# EAGLE design charging_block (EAGLE 8.2.0)
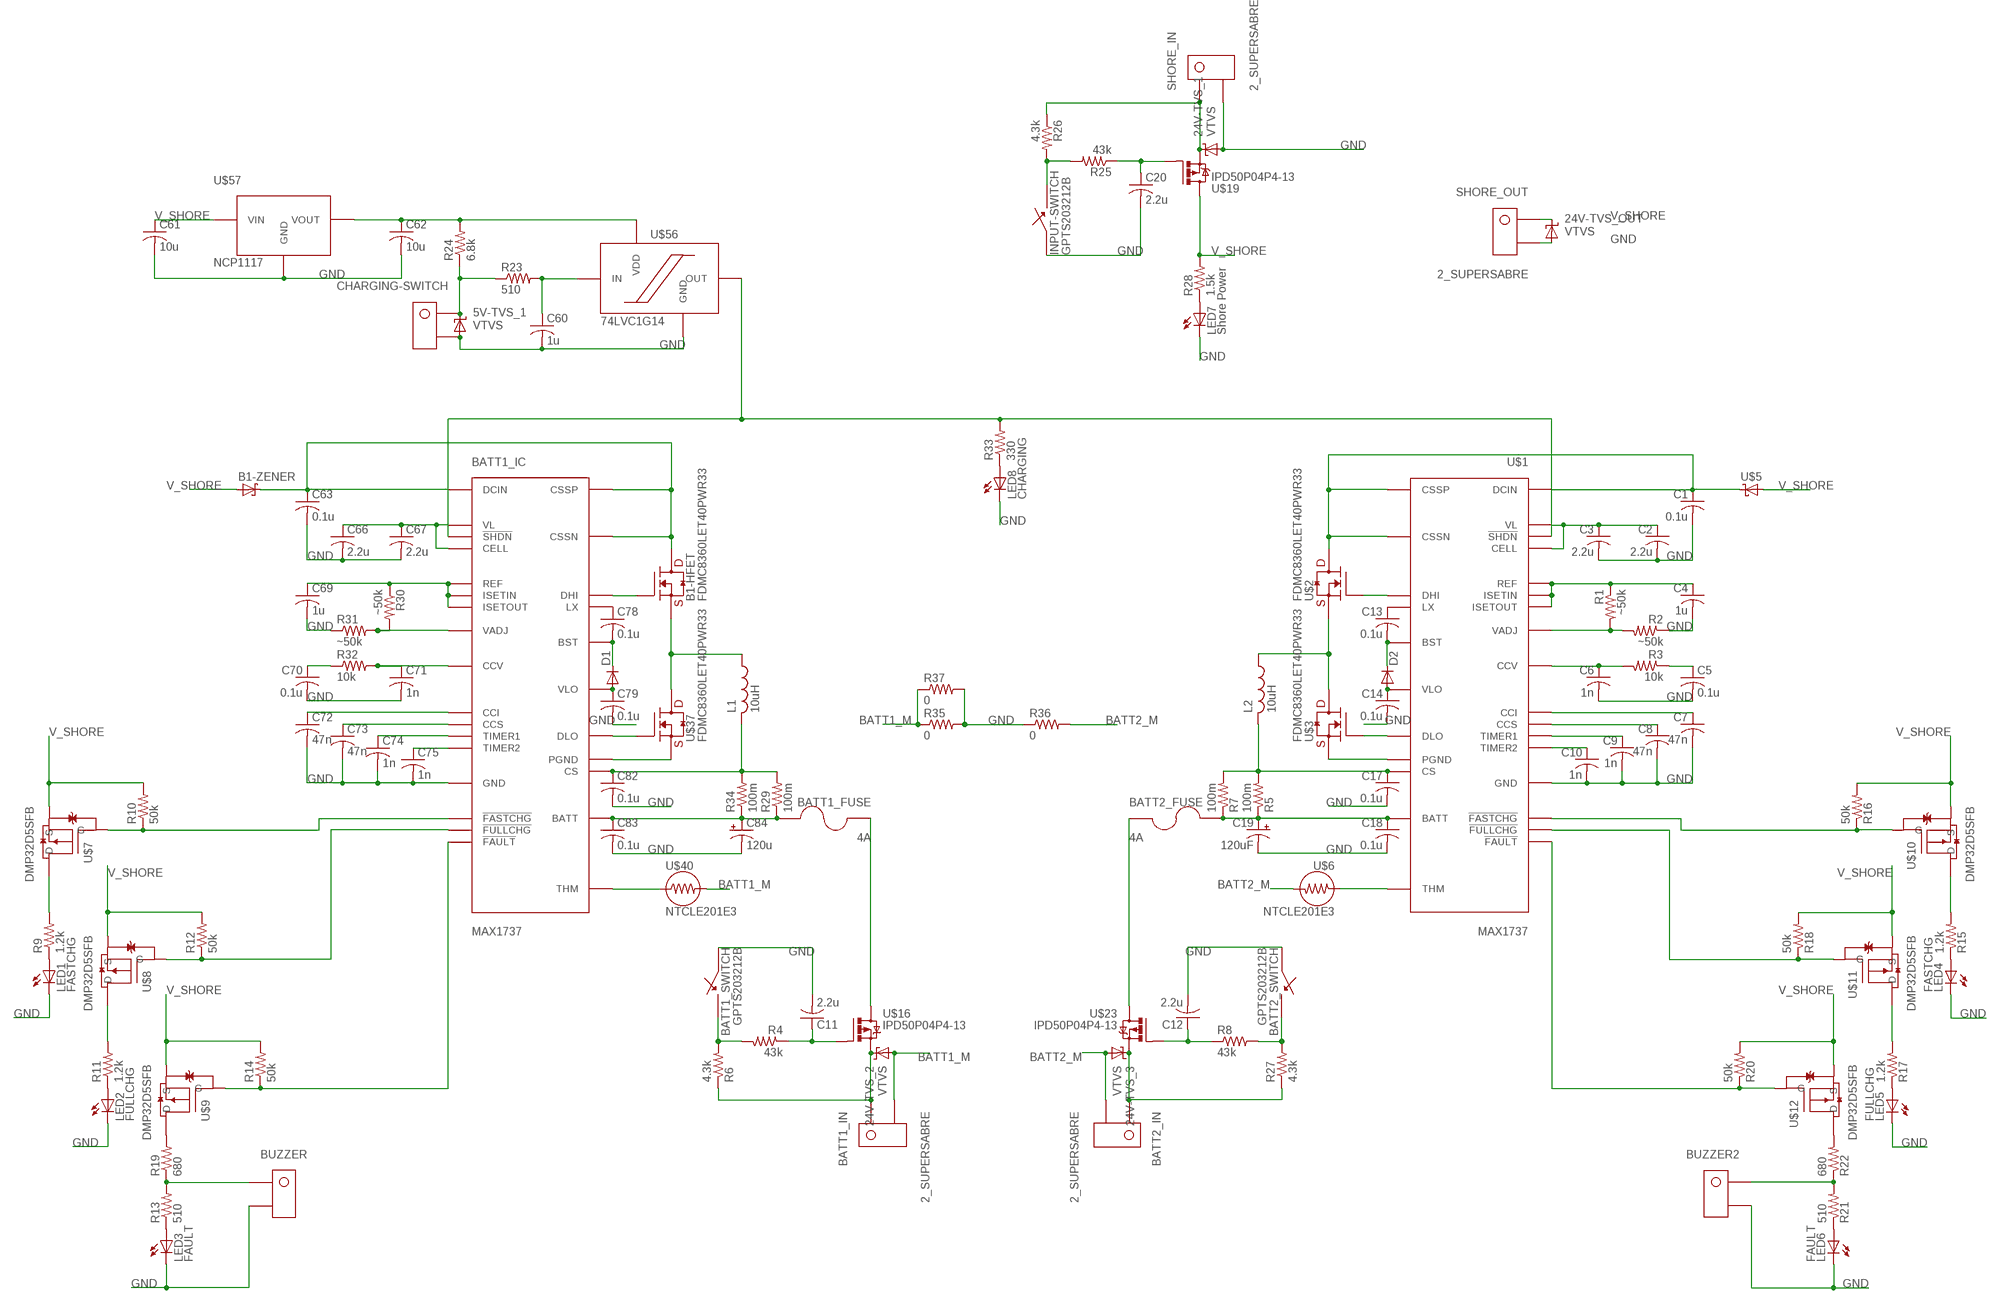
[diagram p0: schematic, sheet 1]

## Parts
5V-TVS_1  VTVS  [DO-219AB]
24V-TVS_1  VTVS  [DO-219AB]
24V-TVS_2  VTVS  [DO-219AB]
24V-TVS_3  VTVS  [DO-219AB]
24V-TVS_OUT  VTVS  [DO-219AB]
B1-HFET  FDMC8360LET40PWR33  [POWER33]
B1-ZENER  SCHOTTKY-DIODESOD-106  [SOD106-R]
BATT1_FUSE  4A  154-OMNI_BLOK  [154-OMNI-BLOK]
BATT1_IC  MAX1737  [QSOP28]
BATT1_IN  2_SUPERSABRE  [SUPERSABRE_2CIRCUIT]
BATT1_SWITCH  GPTS203212B  [GPTS203211B]
BATT2_FUSE  4A  154-OMNI_BLOK  [154-OMNI-BLOK]
BATT2_IN  2_SUPERSABRE  [SUPERSABRE_2CIRCUIT]
BATT2_SWITCH  GPTS203212B  [GPTS203211B]
BUZZER  KK254_VERT_2PIN22-29-2021  [KK254_VERT_2PIN]
BUZZER2  KK254_VERT_2PIN22-29-2021  [KK254_VERT_2PIN]
C1  0.1u  C-USC0805  [C0805]
C2  2.2u  C-USC0805  [C0805]
C3  2.2u  C-USC0805  [C0805]
C4  1u  C-USC0805  [C0805]
C5  0.1u  C-USC0805  [C0805]
C6  1n  C-USC0805  [C0805]
C7  47n  C-USC0805  [C0805]
C8  47n  C-USC0805  [C0805]
C9  1n  C-USC0805  [C0805]
C10  1n  C-USC0805  [C0805]
C11  2.2u  C-USC0805  [C0805]
C12  2.2u  C-USC0805  [C0805]
C13  0.1u  C-USC0805  [C0805]
C14  0.1u  C-USC0805  [C0805]
C17  0.1u  C-USC0805  [C0805]
C18  0.1u  C-USC0805  [C0805]
C19  120uF  CPOL-USE3.5-8  [E3,5-8]
C20  2.2u  C-USC0805  [C0805]
C60  1u  C-USC0805  [C0805]
C61  10u  C-USC0805  [C0805]
C62  10u  C-USC0805  [C0805]
C63  0.1u  C-USC0805  [C0805]
C66  2.2u  C-USC0805  [C0805]
C67  2.2u  C-USC0805  [C0805]
C69  1u  C-USC0805  [C0805]
C70  0.1u  C-USC0805  [C0805]
C71  1n  C-USC0805  [C0805]
C72  47n  C-USC0805  [C0805]
C73  47n  C-USC0805  [C0805]
C74  1n  C-USC0805  [C0805]
C75  1n  C-USC0805  [C0805]
C78  0.1u  C-USC0805  [C0805]
C79  0.1u  C-USC0805  [C0805]
C82  0.1u  C-USC0805  [C0805]
C83  0.1u  C-USC0805  [C0805]
C84  120u  CPOL-USE3.5-8  [E3,5-8]
CHARGING-SWITCH  KK254_VERT_2PIN22-29-2021  [KK254_VERT_2PIN]
D1  DIODE-SOD123  [SOD123]
D2  DIODE-SOD123  [SOD123]
INPUT-SWITCH  GPTS203212B  [GPTS203211B]
L1  10uH  L-USL6100  [L6100]
L2  10uH  L-USL6100  [L6100]
LED1  FASTCHG  LEDCHIP-LED0805  [CHIP-LED0805]
LED2  FULLCHG  LEDCHIP-LED0805  [CHIP-LED0805]
LED3  FAULT  LEDCHIP-LED0805  [CHIP-LED0805]
LED4  FASTCHG  LEDCHIP-LED0805  [CHIP-LED0805]
LED5  FULLCHG  LEDCHIP-LED0805  [CHIP-LED0805]
LED6  FAULT  LEDCHIP-LED0805  [CHIP-LED0805]
LED7  Shore Power  LEDCHIP-LED0805  [CHIP-LED0805]
LED8  CHARGING  LEDCHIP-LED0805  [CHIP-LED0805]
R1  ~50k  R-US_R0805  [R0805]
R2  ~50k  R-US_R0805  [R0805]
R3  10k  R-US_R0805  [R0805]
R4  43k  R-US_R0805  [R0805]
R5  100m  R-US_R2512  [R2512]
R6  4.3k  R-US_R0805  [R0805]
R7  100m  R-US_R2512  [R2512]
R8  43k  R-US_R0805  [R0805]
R9  1.2k  R-US_R0805  [R0805]
R10  50k  R-US_R0805  [R0805]
R11  1.2k  R-US_R0805  [R0805]
R12  50k  R-US_R0805  [R0805]
R13  510  R-US_R0805  [R0805]
R14  50k  R-US_R0805  [R0805]
R15  1.2k  R-US_R0805  [R0805]
R16  50k  R-US_R0805  [R0805]
R17  1.2k  R-US_R0805  [R0805]
R18  50k  R-US_R0805  [R0805]
R19  680  R-US_R0805  [R0805]
R20  50k  R-US_R0805  [R0805]
R21  510  R-US_R0805  [R0805]
R22  680  R-US_R0805  [R0805]
R23  510  R-US_R0805  [R0805]
R24  6.8k  R-US_R0805  [R0805]
R25  43k  R-US_R0805  [R0805]
R26  4.3k  R-US_R0805  [R0805]
R27  4.3k  R-US_R0805  [R0805]
R28  1.5k  R-US_R0805  [R0805]
R29  100m  R-US_R2512  [R2512]
R30  ~50k  R-US_R0805  [R0805]
R31  ~50k  R-US_R0805  [R0805]
R32  10k  R-US_R0805  [R0805]
R33  330  R-US_R0805  [R0805]
R34  100m  R-US_R2512  [R2512]
R35  0  R-US_R0805  [R0805]
R36  0  R-US_R0805  [R0805]
R37  0  R-US_R0805  [R0805]
SHORE_IN  2_SUPERSABRE  [SUPERSABRE_2CIRCUIT]
SHORE_OUT  2_SUPERSABRE  [SUPERSABRE_2CIRCUIT]
U$1  MAX1737  [QSOP28]
U$2  FDMC8360LET40PWR33  [POWER33]
U$3  FDMC8360LET40PWR33  [POWER33]
U$5  SCHOTTKY-DIODESOD-106  [SOD106-R]
U$6  NTCLE201E3  [2-0.3MM-LEADS]
U$7  DMP32D5SFB  [AP02002]
U$8  DMP32D5SFB  [AP02002]
U$9  DMP32D5SFB  [AP02002]
U$10  DMP32D5SFB  [AP02002]
U$11  DMP32D5SFB  [AP02002]
U$12  DMP32D5SFB  [AP02002]
U$16  IPD50P04P4-13  [TO252-3]
U$19  IPD50P04P4-13  [TO252-3]
U$23  IPD50P04P4-13  [TO252-3]
U$37  FDMC8360LET40PWR33  [POWER33]
U$40  NTCLE201E3  [2-0.3MM-LEADS]
U$56  74LVC1G14  [TSSOP5]
U$57  NCP1117  [SOT-223]

## Nets
!SHDN!: BATT1_IC.18(!SHDN!) R33.2 U$1.18(!SHDN!) U$56.P$4(OUT)
BATT1_M: 24V-TVS_2.P$1(A) BATT1_IN.P$2 R35.1 R37.1 U$40.P$2
BATT1_P: 24V-TVS_2.P$2(C) BATT1_IN.P$1 R6.1 U$16.TAB(D)
BATT2_M: 24V-TVS_3.P$1(A) BATT2_IN.P$2 R36.2 U$6.P$2
BATT2_P: 24V-TVS_3.P$2(C) BATT2_IN.P$1 R27.1 U$23.TAB(D)
BATT_1: BATT1_FUSE.P$2 BATT1_IC.7(BATT) C83.1 C84.+ R29.1 R34.1
BATT_2: BATT2_FUSE.P$2 C18.1 C19.+ R5.1 R7.1 U$1.7(BATT)
CS_1: BATT1_IC.19(CS) C82.1 L1.P$2 R29.2 R34.2
CS_2: C17.1 L2.P$2 R5.2 R7.2 U$1.19(CS)
DCIN_2: C1.1 U$1.26(CSSN) U$1.27(CSSP) U$1.28(DCIN) U$2.DRAIN U$5.C
DHI_2: U$1.25(DHI) U$2.GATE
DLO_2: U$1.21(DLO) U$3.GATE
FET-D_1: BATT1_FUSE.P$1 U$16.3(S)
FET-G_1: C11.1 R4.1 U$16.1(G)
GND: 5V-TVS_1.P$1(A) 24V-TVS_1.P$1(A) 24V-TVS_OUT.P$1(A) BATT1_IC.6(GND) BATT1_SWITCH.P$1 BATT2_SWITCH.P$1 BUZZER2.P$2 BUZZER.P$2 C1.2 C2.2 C3.2 C4.2 C5.2 C6.2 C7.2 C8.2 C9.2 C10.2 C11.2 C12.2 C14.2 C17.2 C18.2 C19.- C20.2 C60.2 C61.2 C62.2 C63.2 C66.2 C67.2 C69.2 C70.2 C71.2 C72.2 C73.2 C74.2 C75.2 C79.2 C82.2 C83.2 C84.- CHARGING-SWITCH.P$2 INPUT-SWITCH.P$1 LED1.C LED2.C LED3.C LED4.C LED5.C LED6.C LED7.C LED8.C R2.1 R31.1 R35.2 R36.1 R37.2 SHORE_IN.P$2 SHORE_OUT.P$2 U$1.6(GND) U$56.P$3(GND) U$57.P$1(GND)
L-IN_2: L2.P$1 U$2.SOURCE1(SOURCE) U$2.SOURCE2(SOURCE) U$2.SOURCE3(SOURCE) U$3.DRAIN
N$1: C6.1 R3.2 U$1.9(CCV)
N$2: LED1.A R9.1
N$3: C2.1 C3.1 U$1.1(VL) U$1.12(CELL)
N$4: C4.1 R1.1 U$1.2(ISETIN) U$1.3(ISETOUT) U$1.5(REF)
N$5: C5.1 R3.1
N$6: R1.2 R2.2 U$1.8(VADJ)
N$7: C7.1 U$1.11(CCI)
N$8: C8.1 U$1.10(CCS)
N$9: C9.1 U$1.13(TIMER1)
N$10: C10.1 U$1.14(TIMER2)
N$12: LED3.A R13.1
N$13: C13.1 U$1.24(LX)
N$14: C13.2 D2.C U$1.23(BST)
N$19: C14.1 D2.A U$1.22(VLO)
N$22: LED2.A R11.1
N$23: R9.2 U$7.P$3(D)
N$24: BATT1_IC.16(!FASTCHG!) R10.1 U$7.P$2(G)
N$25: LED4.A R15.1
N$26: R11.2 U$8.P$3(D)
N$27: BATT1_IC.17(!FULLCHG!) R12.1 U$8.P$2(G)
N$28: R15.2 U$10.P$3(D)
N$29: BUZZER.P$1 R13.2 R19.1
N$30: R19.2 U$9.P$3(D)
N$31: BATT1_IC.15(!FAULT!) R14.1 U$9.P$2(G)
N$32: R18.1 U$1.17(!FULLCHG!) U$11.P$2(G)
N$33: LED5.A R17.1
N$34: R17.2 U$11.P$3(D)
N$35: LED7.A R28.1
N$36: R20.1 U$1.15(!FAULT!) U$12.P$2(G)
N$37: LED6.A R21.1
N$38: R16.1 U$1.16(!FASTCHG!) U$10.P$2(G)
N$39: BUZZER2.P$1 R21.2 R22.1
N$40: B1-HFET.DRAIN B1-ZENER.C BATT1_IC.26(CSSN) BATT1_IC.27(CSSP) BATT1_IC.28(DCIN) C63.1
N$41: R22.2 U$12.P$3(D)
N$44: BATT2_FUSE.P$1 U$23.3(S)
N$47: C20.1 R25.1 U$19.1(G)
N$49: C60.1 R23.2 U$56.P$2(IN)
N$50: 5V-TVS_1.P$2(C) CHARGING-SWITCH.P$1 R23.1 R24.1
N$51: INPUT-SWITCH.P$2 R25.2 R26.2
N$52: BATT1_SWITCH.P$2 R4.2 R6.2
N$53: C12.1 R8.1 U$23.1(G)
N$54: C62.1 R24.2 U$56.P$5(VDD) U$57.P$2(VOUT) U$57.P$4(VOUT)
N$55: BATT2_SWITCH.P$2 R8.2 R27.2
N$57: LED8.A R33.1
N$62: BATT1_IC.8(VADJ) R30.2 R31.2
N$64: C70.1 R32.1
N$65: BATT1_IC.1(VL) BATT1_IC.12(CELL) C66.1 C67.1
N$67: BATT1_IC.9(CCV) C71.1 R32.2
N$68: BATT1_IC.2(ISETIN) BATT1_IC.3(ISETOUT) BATT1_IC.5(REF) C69.1 R30.1
N$69: BATT1_IC.11(CCI) C72.1
N$70: BATT1_IC.10(CCS) C73.1
N$71: BATT1_IC.13(TIMER1) C74.1
N$72: BATT1_IC.14(TIMER2) C75.1
N$75: BATT1_IC.24(LX) C78.1
N$76: BATT1_IC.23(BST) C78.2 D1.C
N$79: BATT1_IC.21(DLO) U$37.GATE
N$80: B1-HFET.GATE BATT1_IC.25(DHI)
N$81: B1-HFET.SOURCE1(SOURCE) B1-HFET.SOURCE2(SOURCE) B1-HFET.SOURCE3(SOURCE) L1.P$1 U$37.DRAIN
N$82: BATT1_IC.20(PGND) U$37.SOURCE1(SOURCE) U$37.SOURCE2(SOURCE) U$37.SOURCE3(SOURCE)
N$83: BATT1_IC.22(VLO) C79.1 D1.A
N$84: BATT1_IC.4(THM) U$40.P$1
PGND_2: U$1.20(PGND) U$3.SOURCE1(SOURCE) U$3.SOURCE2(SOURCE) U$3.SOURCE3(SOURCE)
THM_2: U$1.4(THM) U$6.P$1
V_SHORE: 24V-TVS_OUT.P$2(C) B1-ZENER.A C61.1 R10.2 R12.2 R14.2 R16.2 R18.2 R20.2 R28.2 SHORE_OUT.P$1 U$5.A U$7.P$1(S) U$8.P$1(S) U$9.P$1(S) U$10.P$1(S) U$11.P$1(S) U$12.P$1(S) U$19.3(S) U$57.P$3(VIN)
VIN: 24V-TVS_1.P$2(C) R26.1 SHORE_IN.P$1 U$19.TAB(D)

## Library data of the parts
5V-TVS_1 24V-TVS_1-24V-TVS_3 24V-TVS_OUT = diode:VTVS: Vishay VTVS5V0ASMF to VTVS63GSMF 400W TVS diodes Datasheet <http://www.mouser.com/ds/2/427/vtvs5v0asmf-1078013.pdf>
B1-HFET U$2 U$3 U$37 = fairchild:FDMC8360LET40
B1-ZENER U$5 = diode:SCHOTTKY-DIODE: Schottky Diode
BATT1_FUSE BATT2_FUSE = littelfuse:154-OMNI_BLOK: Littelfuse NANO2 Series 154 Omni-Blok fuseholder Datasheet <http://www.mouser.com/ds/2/240/Littelfuse_Fuse_154_154T_154L_154TL_Datasheet.pdf-309941.pdf>
BATT1_IC U$1 = maxim:MAX1737: Maxim MAX1737 Stand-Alone Switch-Mode Lithium-Ion Battery-Charger Controller 1-4 cell LiPo charge controller IC Datasheet <https://datasheets.maximintegrated.com/en/ds/MAX1737.pdf>
BATT1_IN BATT2_IN SHORE_IN SHORE_OUT = molex:2_SUPERSABRE: Molex SuperSabre 2-pin vertical header
BATT1_SWITCH BATT2_SWITCH INPUT-SWITCH = switches:GPTS203212B: CW Industries Pushbutton SPST switch ON-OFF, 1A, 30VDC Datasheet <http://switches-connectors-custom.cwind.com/Asset/GPTS203211BR2.pdf>
BUZZER BUZZER2 CHARGING-SWITCH = molex:KK254_VERT_2PIN: KK® 254 Wire-to-Board Header, Vertical, with Friction Lock, 2 Circuits, Gold (Au) Plating Part Number: 22-29-2021 http://www.molex.com/molex/products/datasheet.jsp?part=active/0022292021_PCB_HEADERS.xml
C1-C14 C17 C18 C20 C60-C63 C66 C67 C69-C75 C78 C79 C82 C83 = resistor:C-US: CAPACITOR, American symbol
C19 C84 = resistor:CPOL-US: POLARIZED CAPACITOR, American symbol
D1 D2 = diode:DIODE-: DIODE
L1 L2 = resistor:L-US: INDUCTOR, American symbol
LED1-LED8 = led:LED: LED OSRAM: - CHIPLED LG R971, LG N971, LY N971, LG Q971, LY Q971, LO R971, LY R971 LH N974, LH R974 LS Q976, LO Q976, LY Q976 LO Q996 - Hyper CHIPLED LW Q18S LB Q993, LB Q99A, LB R99A - SideLED LS A670, LO A670, LY A670, LG A670, LP A670 LB A673, LV A673, LT A673, LW A673 LH A674 LY A675 LS A676, LA A676, LO A676, LY A676, LW A676 LS A679, LY A679, LG A679 - Hyper Micro SIDELED® LS Y876, LA Y876, LO Y876, LY Y876 LT Y87S - SmartLED LW L88C, LW L88S LB L89C, LB L89S, LG L890 LS L89K, LO L89K, LY L89K LS L896, LA L896, LO L896, LY L896 - TOPLED LS T670, LO T670, LY T670, LG T670, LP T670 LSG T670, LSP T670, LSY T670, LOP T670, LYG T670 LG T671, LOG T671, LSG T671 LB T673, LV T673, LT T673, LW T673 LH T674 LS T676, LA T676, LO T676, LY T676, LB T676, LH T676, LSB T676, LW T676 LB T67C, LV T67C, LT T67C, LS T67K, LO T67K, LY T67K, LW E67C LS E67B, LA E67B, LO E67B, LY E67B, LB E67C, LV E67C, LT E67C LW T67C LS T679, LY T679, LG T679 LS T770, LO T770, LY T770, LG T770, LP T770 LB T773, LV T773, LT T773, LW T773 LH T774 LS E675, LA E675, LY E675, LS T675 LS T776, LA T776, LO T776, LY T776, LB T776 LHGB T686 LT T68C, LB T68C - Hyper Mini TOPLED® LB M676 - Mini TOPLED Santana® LG M470 LS M47K, LO M47K, LY M47K Source: http://www.osram.convergy.de LUXEON: - LUMILED® LXK2-PW12-R00, LXK2-PW12-S00, LXK2-PW14-U00, LXK2-PW14-V00 LXK2-PM12-R00, LXK2-PM12-S00, LXK2-PM14-U00 LXK2-PE12-Q00, LXK2-PE12-R00, LXK2-PE12-S00, LXK2-PE14-T00, LXK2-PE14-U00 LXK2-PB12-K00, LXK2-PB12-L00, LXK2-PB12-M00, LXK2-PB14-N00, LXK2-PB14-P00, LXK2-PB14-Q00 LXK2-PR12-L00, LXK2-PR12-M00, LXK2-PR14-Q00, LXK2-PR14-R00 LXK2-PD12-Q00, LXK2-PD12-R00, LXK2-PD12-S00 LXK2-PH12-R00, LXK2-PH12-S00 LXK2-PL12-P00, LXK2-PL12-Q00, LXK2-PL12-R00 Source: www.luxeon.com KINGBRIGHT: KA-3528ASYC Source: www.kingbright.com
R1-R37 = resistor:R-US_: RESISTOR, American symbol
U$6 U$40 = vishay:NTCLE201E3: Vishay NTC Thermistor Part No. NTCLE201E3 Datasheet <http://www.mouser.com/ds/2/427/ntclesb-278158.pdf>
U$7-U$12 = transistor-fet:DMP32D5SFB: Diodes Inc. DMP32D5SFB 30V P-MOSFET (Enhancement) Datasheet <http://www.mouser.com/ds/2/115/DMP32D5SFB-765036.pdf>
U$16 U$19 U$23 = transistor-power:IPD50P04P4-13: Infineon IPD50P04P4-13 OptiMOS®-P2 Power-Transistor Datasheet <http://www.mouser.com/ds/2/196/Infineon-IPD50P04P4-13-DS-v01_02-EN-336147.pdf>
U$56 = NXP:74LVC1G14: Nexperia 74LVC1G14 Single Schmitt trigger inverter Datasheet <http://www.mouser.com/ds/2/302/74LVC1G14_Q100-839654.pdf>
U$57 = ONSemi:NCP1117: ON Semiconductor NCP1117 5V 1A Fixed LDO Datasheet <http://www.mouser.com/ds/2/308/NCP1117-D-81326.pdf>

## Board
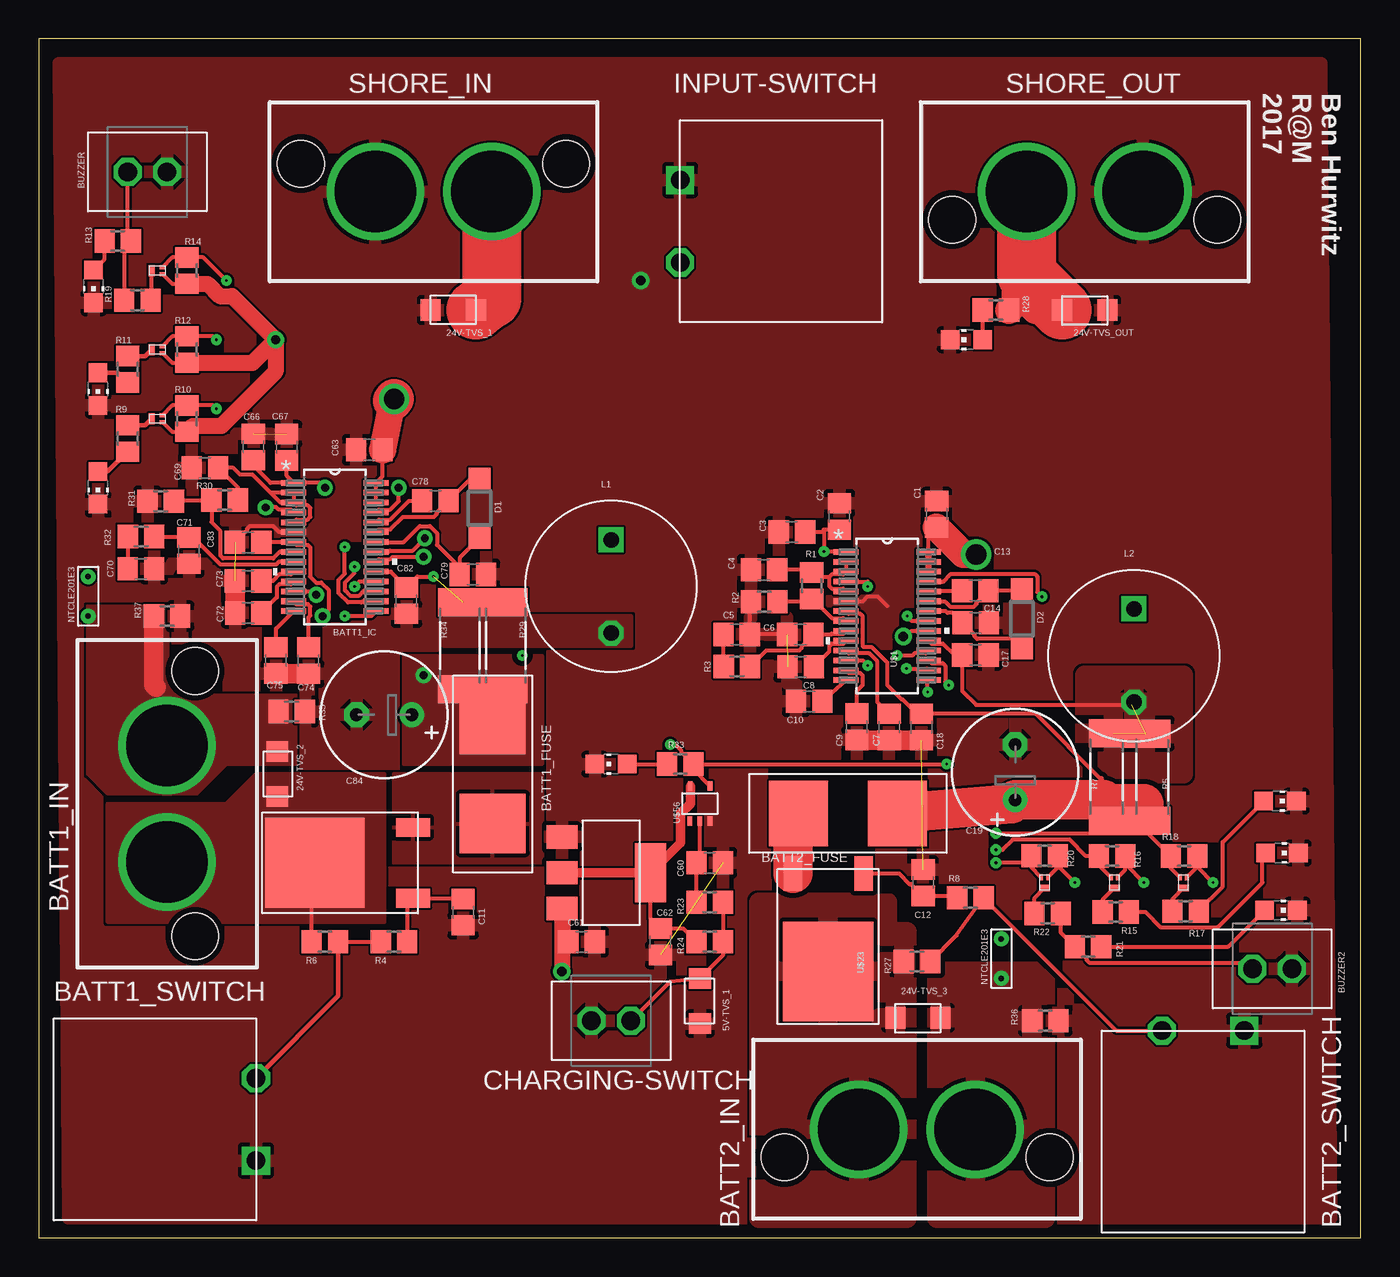
[diagram p1: board, top side]
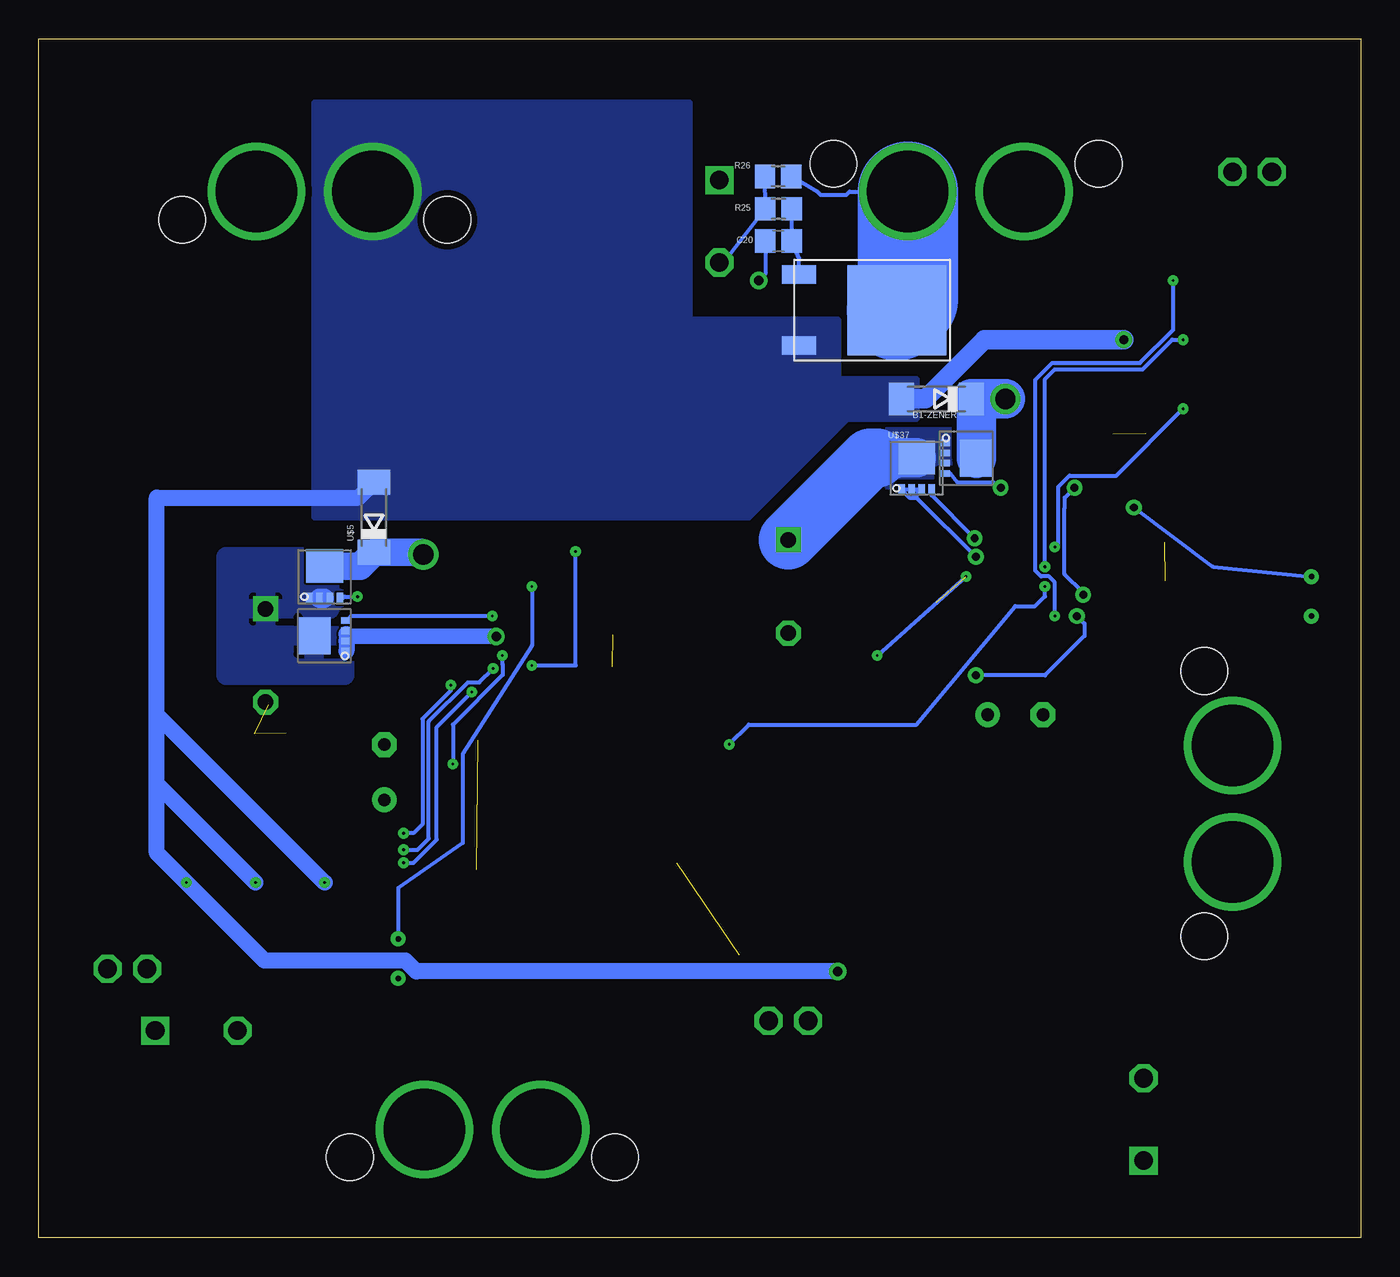
[diagram p2: board, bottom side, seen from below]

Size 85.07 x 77.14 mm. Coordinates in mm from the lower left corner, seen from the top.
Outline: 0,0 85.07,0 85.07,77.14 0,77.14 0,0
Copper layers (1*16): Top 0.0356mm / dielectric 1.5011mm / Bottom 0.0356mm
Design rules "OshPark *": minimum track width 6mil, minimum drill 7mil, track to track 6mil, track to pad 6mil, pad to pad 6mil, via to via 6mil, smd to smd 6mil, copper to edge 15mil, drill to drill 6mil, minimum pad ring 12mil, minimum via ring 10mil, stop-mask expansion 6mil, vias tented up to drill 0mil, thermal gap 10mil

### Footprints (pad centres in the part's own frame; a part is rotated, then mirrored left to right if it is on the bottom)
DO-219AB = smd 1.3 x 1.4: P$1 -1.45,0; P$2 1.45,0
POWER33 = smd 2.37 x 2.15: DRAIN 0,0.675 | smd 0.42 x 0.7: GATE 0.975,-1.4; SOURCE1 -0.975,-1.4; SOURCE2 -0.325,-1.4; SOURCE3 0.325,-1.4
SOD106-R = smd 1.6 x 2.1: A 2.25,0; C -2.25,0
154-OMNI-BLOK = smd 3.81 x 4.242: P$1 -3.188,0; P$2 3.188,0
QSOP28 = smd 1.6 x 0.356: 1 -2.654,4.128; 2 -2.654,3.493; 3 -2.654,2.857; 4 -2.654,2.223; 5 -2.654,1.587; 6 -2.654,0.953; 7 -2.654,0.318; 8 -2.654,-0.318; 9 -2.654,-0.953; 10 -2.654,-1.587; 11 -2.654,-2.223; 12 -2.654,-2.857; 13 -2.654,-3.493; 14 -2.654,-4.128; 15 2.654,-4.128; 16 2.654,-3.493; 17 2.654,-2.857; 18 2.654,-2.223; 19 2.654,-1.587; 20 2.654,-0.953; 21 2.654,-0.318; 22 2.654,0.318; 23 2.654,0.953; 24 2.654,1.587; 25 2.654,2.223; 26 2.654,2.857; 27 2.654,3.493; 28 2.654,4.128
SUPERSABRE_2CIRCUIT = drill 5.25: P$1 -3.747,0; P$2 3.747,0 | hole 2.997: -8.534,-1.803; 8.534,-1.803
GPTS203211B = drill 1.2 square: P$1 0,-2.65 | drill 1.2 octagon: P$2 0,2.65
KK254_VERT_2PIN = drill 1.2 octagon: P$1 1.27,0; P$2 -1.27,0
C0805 = smd 1.3 x 1.5: 1 -0.85,0; 2 0.85,0
E3,5-8 = drill 0.813 pad 1.6: + -1.778,0 | drill 0.813 pad 1.6 octagon: - 1.778,0
SOD123 = smd 1.4 x 1.4: A 1.9,0; C -1.9,0
L6100 = drill 1 square: P$1 -3,0 | drill 1 octagon: P$2 3,0
CHIP-LED0805 = smd 1.2 x 1.2: A 0,-1.05; C 0,1.05
R0805 = smd 1.3 x 1.5: 1 -0.85,0; 2 0.85,0
R2512 = smd 1.8 x 3.2: 1 -2.8,0; 2 2.8,0
2-0.3MM-LEADS = drill 0.35: P$1 -1.27,0; P$2 1.27,0
AP02002 = smd 0.4 x 0.25: P$1 -0.35,0.225; P$2 -0.35,-0.225 | smd 0.4 x 0.7: P$3 0.35,0
TO252-3 = smd 1.2 x 2.2: 1 -2.28,-6.3; 3 2.28,-6.3 | smd 5.8 x 6.4: TAB 0,0
TSSOP5 = smd 0.3 x 0.6: P$1 -0.65,-1.125; P$2 0,-1.125; P$3 0.65,-1.125; P$4 0.65,1.125; P$5 -0.62,1.125
SOT-223 = smd 1.5 x 2: P$1 -2.3,-3.15; P$2 0,-3.15; P$3 2.3,-3.15 | smd 3.8 x 2: P$4 0,2.54

### Placement (x,y rotation side)
5V-TVS_1  42.55,15.24 90 top
24V-TVS_1  26.67,59.69 0 top
24V-TVS_2  15.35,29.84 270 top
24V-TVS_3  56.57,14.16 180 top
24V-TVS_OUT  67.31,59.69 180 top
B1-HFET  25.4,50.17 270 bottom
B1-ZENER  27.31,53.98 180 bottom
BATT1_FUSE  29.21,29.84 90 top
BATT1_IC  19.05,44.45 0 top
BATT1_IN  8.26,27.94 90 top
BATT1_SWITCH  13.97,7.62 0 top
BATT2_FUSE  52.07,27.3 0 top
BATT2_IN  56.52,6.99 0 top
BATT2_SWITCH  74.93,13.34 90 top
BUZZER  6.99,68.58 180 top
BUZZER2  79.37,17.31 180 top
C1  57.78,46.55 90 top
C2  51.52,46.41 90 top
C3  48.47,45.41 180 top
C4  46.68,42.98 180 top
C5  44.91,38.83 0 top
C6  49.01,38.82 180 top
C7  54.72,32.86 270 top
C8  49.03,36.74 180 top
C9  52.65,32.89 270 top
C10  49.58,34.52 180 top
C11  27.31,20.95 270 top
C12  56.9,22.85 90 top
C13  60.27,41.64 0 top
C14  60.3,39.57 0 top
C17  60.27,37.5 0 top
C18  56.8,32.86 270 top
C19  62.83,29.96 90 top
C20  37.47,64.14 180 bottom
C60  43.18,24.13 0 top
C61  34.92,19.05 0 top
C62  40,19.05 270 top
C63  21.27,50.71 180 top
C66  13.82,50.89 90 top
C67  15.95,50.86 90 top
C69  10.69,49.55 180 top
C70  6.57,43.05 0 top
C71  9.66,44.21 270 top
C72  13.48,40.21 180 top
C73  13.47,42.27 180 top
C74  17.36,37.14 270 top
C75  15.27,37.15 270 top
C78  25.52,47.42 0 top
C79  27.93,42.69 0 top
C82  23.66,41 270 top
C83  13.47,44.75 180 top
C84  22.22,33.66 180 top
CHARGING-SWITCH  36.83,13.97 0 top
D1  28.37,46.94 270 top
D2  63.27,39.84 270 top
INPUT-SWITCH  41.28,65.41 180 top
L1  36.83,41.91 270 top
L2  70.48,37.47 270 top
LED1  3.81,48.26 180 top
LED2  3.81,54.61 180 top
LED3  3.52,61.21 180 top
LED4  80.01,24.77 270 top
LED5  79.87,28.1 270 top
LED6  79.94,21.08 270 top
LED7  59.69,57.78 90 top
LED8  36.83,30.48 90 top
R1  49.74,41.96 270 top
R2  46.69,40.93 0 top
R3  44.93,36.76 0 top
R4  22.86,19.05 180 top
R5  71.23,29.64 90 top
R6  18.42,19.05 0 top
R7  69.16,29.65 90 top
R8  59.96,21.88 0 top
R9  5.71,51.44 90 top
R10  9.53,52.7 270 top
R11  5.71,55.88 90 top
R12  9.53,57.15 270 top
R13  5.08,64.14 0 top
R14  9.53,62.23 270 top
R15  69.31,20.97 180 top
R16  69.07,24.57 0 top
R17  73.8,21.02 180 top
R18  73.7,24.57 0 top
R19  6.35,60.33 0 top
R20  64.73,24.59 0 top
R21  67.52,18.73 180 top
R22  64.93,20.88 180 top
R23  43.18,21.59 180 top
R24  43.18,19.05 180 top
R25  37.47,66.21 180 bottom
R26  37.49,68.29 180 bottom
R27  56.52,17.78 0 top
R28  61.59,59.69 0 top
R29  29.85,38.1 90 top
R30  11.96,47.47 180 top
R31  7.84,47.4 0 top
R32  6.58,45.13 0 top
R33  41.28,30.48 0 top
R34  27.31,38.1 90 top
R35  16.28,33.86 0 top
R36  64.77,13.97 180 top
R37  8.26,40.01 0 top
SHORE_IN  25.4,67.31 180 top
SHORE_OUT  67.31,67.31 0 top
U$1  54.61,40.01 0 top
U$2  66.67,42.55 0 bottom
U$3  66.67,38.73 90 bottom
U$5  63.5,46.36 90 bottom
U$6  61.95,17.97 270 top
U$7  7.62,52.7 180 top
U$8  7.62,57.15 180 top
U$9  7.62,62.23 180 top
U$10  69.22,22.86 270 top
U$11  73.66,22.86 270 top
U$12  64.73,22.86 270 top
U$16  17.78,24.13 90 top
U$19  29.85,59.69 270 bottom
U$23  50.8,17.15 180 top
U$37  28.57,49.53 0 bottom
U$40  3.18,41.27 270 top
U$56  42.55,27.94 0 top
U$57  36.83,23.5 270 top

### Tracks (layer width: path | path; a pad name or v marks a point on that pad's centre or on a via)
!SHDN!  (via drill 0.18)
  Top 0.254: U$56.P$4 42.12,30.14 R33.2 | U$1.18 57.09,37.61 56.35,37.61 56.21,37.47 v55.25,37.47 | R33.2 v58.42,30.48 | R33.2 41.35,31.25 41.35,31.35 40.95,31.75 v40.64,31.75 | 20.97,42.23 BATT1_IC.18 20.64,42.23 v20.32,41.91
  Bottom 0.254: v55.25,37.47 55.25,36.91 55.22,36.89 55.22,36.22 58.42,33.02 v58.42,30.48 | v40.64,31.75 39.37,33.02 28.57,33.02 22.22,40.64 20.96,40.64 20.32,41.27 v20.32,41.91
BATT1_M
  Top 1.27: 7.54,35.43 7.41,35.57 R37.1
  pour Top (no thermals): 13.97,34.93 16.51,34.93 16.51,30.48 13.97,30.48
  pour Top (isolate 0.305, no thermals): 16.51,30.48 12.07,30.48 10.16,28.58 4.45,28.58 3.18,29.84 3.18,40.64 8.26,40.64 8.26,35.56 8.89,34.93 16.51,34.93
BATT1_P
  Top 0.254: R6.1 17.57,23.91 U$16.TAB
  pour Top (isolate 0.305, no thermals): 4.45,27.94 12.07,27.94 13.97,29.84 22.22,29.84 22.22,20.32 4.45,20.32
BATT2_M
  pour Top (isolate 0.305): 57.78,1.27 57.78,17.15 64.77,17.15 64.77,1.27
BATT2_P
  pour Top (isolate 0.305): 46.36,21.59 54.61,21.59 54.61,19.69 55.88,19.69 55.88,1.27 46.36,1.27
BATT_1  (via drill 0.51)
  Top 0.254: 14.5,44.77 C83.1 14.34,44.77 BATT1_IC.7 | 15.66,44.77 BATT1_IC.7 | BATT1_IC.7 16.57,44.59 17.31,44.59 17.47,44.43 17.47,42.57 17.45,42.55 17.83,42.16 18.18,42.16 18.64,41.7 18.64,40.39 v18.26,40.01
  Bottom 0.254: v18.26,40.01 17.78,39.52 17.78,38.73 20.32,36.2 v24.77,36.2
  pour Top (isolate 0.305, no thermals): 23.5,37.47 32.39,37.47 32.39,30.48 23.5,30.48
BATT_2
  Top 0.254: R5.1 71.23,28.05 71.12,27.94 | 68.54,28.18 R7.1 68.39,29.57 68.3,29.57 64.16,33.71 C18.1 56.52,33.71 55.58,34.64 55.53,34.64 54.61,35.56 54.61,37.02 53.61,38.01 53.1,38.01 53.01,38.1 53.03,38.12 53.03,39.98 52.87,40.15 52.13,40.15 U$1.7
  Top 2.54: BATT2_FUSE.P$2 62.6,27.94 C19.+ 68.54,28.18 68.77,27.94 71.12,27.94
CS_1  (via drill 0.18)  (1 unrouted)
  Top 0.254: BATT1_IC.19 22.65,42.86 C82.1 24.36,42.55 v25.4,42.55
  Top 1.27: L1.P$2 36.79,38.95
  Bottom 0.254: v25.4,42.55 v31.11,37.47
  pour Top (isolate 0.305, no thermals): 26.04,38.1 38.1,38.1 38.1,40.01 26.04,40.01
CS_2  (2 unrouted)
  Top 0.254: U$1.19 57.44,38.24 58.18,38.24 58.92,37.5 C17.1 59.42,35.19 60.33,34.29 70.31,34.29 L2.P$2
  pour Top (isolate 0.305): 67.31,29.84 67.31,36.2 73.66,36.2 73.66,29.84
DCIN_2  (via drill 1.3)
  Top 0.254: U$1.28 57.26,45.19 C1.1
  Top 0.406: U$1.28 U$1.26 U$1.27
  Top 1.778: C1.1 59.51,43.97 v60.33,43.97
  Bottom 1.778: v60.33,43.97 60.46,44.11 U$5.C 64.38,43.22 U$2.DRAIN
DHI_2  (via drill 0.18)
  Top 0.254: v64.56,41.25 64.25,41.56 64.25,42.55 64.09,42.72 58.7,42.72 58.21,42.23 U$1.25
  Bottom 0.254: 65.59,41.25 65.41,41.25 v64.56,41.25
  Bottom 0.305: U$2.GATE 65.51,41.15 65.41,41.25
DLO_2  (via drill 0.18)
  Top 0.254: U$1.21 56.2,39.69 v55.88,40.01
  Bottom 0.254: v55.88,40.01 64.98,40.01 U$3.GATE
FET-D_1
  pour Top (isolate 0.305): 22.86,29.84 32.39,29.84 32.39,24.13 22.86,24.13
FET-G_1
  Top 0.254: 23.71,21.48 R4.1 | 23.71,21.48 U$16.1 | C11.1 24.04,21.8 23.71,21.48
GND  (via drill 0.6)  (5 unrouted)
  Top 0.254: C6.2 C5.2 45.76,40.85 R2.1 | U$1.6 53.02,40.96 53.34,41.27 53.97,41.27 54.61,40.64 | BATT1_IC.6 15.47,45.4 15.09,45.78 13.56,45.78 13.39,45.62 13.39,45.52 C83.2
  Top 1.27: C9.2 52.67,32.02 C7.2 C18.2 | C74.2 C75.2 | C72.2 C73.2
  Bottom 0.254: C20.2 38.31,62.02 v38.73,61.59
  pour Top (isolate 0, rank 6): 1.91,1.27 83.19,1.27 82.55,75.56 1.27,75.56
L-IN_2
  Bottom 0.254: U$2.SOURCE3 U$2.SOURCE2
  Bottom 1.27: U$2.SOURCE2 66.7,41.15
  pour Bottom: 65.41,43.81 73.02,43.81 73.02,36.2 65.41,36.2
N$1
  Top 0.254: U$1.9 51.78,38.88 51.04,38.88 50.98,38.82 C6.1 49.09,38.05 49.09,37.95 48.92,37.79 46.81,37.79 R3.2
N$2
  Top 0.305: LED1.A 4.44,49.31 R9.1
N$3  (via drill 0.18)
  Top 0.254: U$1.12 53.02,37.15 v53.34,36.83 | U$1.1 51.96,44.16 v50.53,44.16 50.53,45.41 | 50.53,45.41 C3.1 | C2.1 50.53,45.56 50.53,45.41
  Bottom 0.254: v53.34,36.83 50.53,36.83 v50.53,44.16
N$4
  Top 0.254: U$1.2 U$1.3 51.78,42.69 51.04,42.69 50.88,42.52 | 50.88,42.52 50.88,41.93 51.04,41.77 51.78,41.77 U$1.5 | 50.88,42.52 49.74,42.52 R1.1 49.74,42.98 C4.1
N$5
  Top 0.254: R3.1 44.08,38.81 C5.1
N$6
  Top 0.254: R2.2 49.74,40.93 R1.2 49.8,41.11 51.04,39.87 51.78,39.87 U$1.8
N$7
  Top 0.254: U$1.11 52.13,37.61 53.44,37.61 53.96,37.09 53.96,34.47 C7.1
N$8
  Top 0.254: U$1.10 51.78,38.24 51.04,38.24 50.88,38.08 50.88,37.73 C8.1
N$9
  Top 0.254: U$1.13 52.13,36.34 52.87,36.34 53.03,36.17 53.03,35.58 52.65,35.2 C9.1
N$10
  Top 0.254: C10.1 U$1.14
N$12
  Top 0.254: LED3.A 4.23,62.97 R13.1
N$13
  Top 0.254: U$1.24 57.26,41.64 C13.1
N$14
  Top 0.254: U$1.23 58.31,40.96 58.65,40.61 60.19,40.61 60.35,40.77 60.35,40.87 C13.2 63.17,41.64 D2.C
N$19
  Top 0.254: U$1.22 58.37,40.32 58.49,40.2 58.81,40.2 C14.1 60.22,38.8 60.22,38.71 60.38,38.54 62.66,38.54 D2.A
N$22
  Top 0.305: LED2.A 5.09,55.66 R11.1
N$23
  Top 0.305: R9.2 6.85,52.28 U$7.P$3
N$24  (via drill 0.18)
  Top 0.254: U$7.P$2 8.6,53.56 R10.1 11.21,53.56 v11.43,53.34 | BATT1_IC.16 20.82,40.96 20.75,40.88 19.89,40.88 19.29,41.48 19.29,42.34 19.68,42.73 v19.68,44.45
  Bottom 0.254: v19.68,44.45 19.47,44.67 19.47,48.32 18.74,49.05 15.72,49.05 v11.43,53.34
N$25
  Top 0.254: R15.1 71.21,20.97 72.19,19.99 75.87,19.99 78.74,22.86 78.74,24.55 LED4.A
N$26
  Top 0.305: R11.2 6.85,56.73 U$8.P$3
N$27  (via drill 0.18)
  Top 0.254: U$8.P$2 8.6,58 R12.1 11.21,58 v11.43,57.78 | BATT1_IC.17 20.88,41.59 20.58,41.29 20.06,41.29 19.7,41.65 19.7,42.17 20.32,42.79 v20.32,43.18
  Bottom 0.254: v20.32,43.18 20.32,55.25 19.68,55.88 14.03,55.88 12.12,57.78 v11.43,57.78
N$28
  Top 0.254: U$10.P$3 68.46,21.75 R15.2
N$29
  Top 0.254: R19.1 5.5,63.7 R13.2 5.71,64.35 BUZZER.P$1
N$30
  Top 0.254: R19.2 7.27,60.39 U$9.P$3
N$31  (via drill 0.18)
  Top 0.254: U$9.P$2 8.6,63.08 R14.1 10.58,63.08 v12.07,61.59 | BATT1_IC.15 21.39,40.01 v19.68,40.01
  Bottom 0.254: v19.68,40.01 19.68,42.18 20.06,42.56 20.58,42.56 20.94,42.92 20.94,55.2 19.85,56.29 14.2,56.29 12.07,58.42 v12.07,61.59
N$32  (via drill 0.18)
  Top 0.254: U$11.P$2 72.85,23.79 R18.1 71.38,26.04 v61.59,26.04 | v58.56,35.56 58.34,35.78 58.34,36.81 58.18,36.97 57.44,36.97 U$1.17
  Bottom 0.254: v58.56,35.56 58.56,35.22 60.38,33.39 60.38,26.61 60.96,26.04 v61.59,26.04
N$33
  Top 0.254: R17.1 74.65,21.07 76.19,22.6 76.19,25.47 LED5.A
N$34
  Top 0.254: U$11.P$3 72.95,21.8 R17.2
N$35
  Top 0.254: LED7.A R28.1
N$36  (via drill 0.18)
  Top 0.254: U$12.P$2 63.88,23.84 R20.1 63.42,24.13 v61.59,24.13 | v57.2,35.12 57.2,35.81 U$1.15
  Bottom 0.254: v61.59,24.13 60.96,24.13 59.46,25.63 59.46,32.86 v57.2,35.12
N$37
  Top 0.254: R21.1 76.55,18.73 LED6.A
N$38  (via drill 0.18)
  Top 0.254: U$10.P$2 68.22,23.98 R16.1 67.39,24.57 66.35,25.62 62.67,25.62 62.03,24.97 v61.59,24.97 | v55.84,36.63 57.15,36.63 U$1.16
  Bottom 0.254: v61.59,24.97 60.7,24.97 59.98,25.69 59.98,33.22 57.46,35.74 56.72,35.74 v55.84,36.63
N$39
  Top 0.254: R22.1 65.78,19.63 R21.2 67.44,17.96 67.44,17.87 67.61,17.7 77.71,17.7 BUZZER2.P$1
N$40  (via drill 1.3)
  Top 0.254: C63.1 22.12,49 BATT1_IC.28 BATT1_IC.27 BATT1_IC.26
  Top 1.778: C63.1 22.76,53.87
  Top 2.54: 22.76,53.87 v22.86,53.98
  Bottom 2.54: B1-HFET.DRAIN 24.72,53.64 B1-ZENER.C v22.86,53.98
N$41
  Top 0.254: R22.2 64.08,21.86 U$12.P$3
N$44
  Top 2.54: U$23.3 48.52,27.58 BATT2_FUSE.P$1
N$47
  Bottom 0.254: U$19.1 36.14,63.03 C20.1 R25.1
N$49
  Top 0.254: R23.2 C60.1 | 42.33,24.5 C60.1 | C60.1 42.55,24.34 U$56.P$2
N$50
  Top 0.254: R23.1 R24.1 44.03,18.18 5V-TVS_1.P$2 40.64,16.51 CHARGING-SWITCH.P$1
N$51
  Bottom 0.254: R26.2 R25.2 40.97,62.75 INPUT-SWITCH.P$2
N$52
  Top 0.254: R6.2 R4.2
  Top 0.305: BATT1_SWITCH.P$2 19.27,15.57 R6.2
N$53
  Top 0.254: U$23.1 55.36,23.45 56.04,22.77 56.13,22.77 C12.1 58.99,22 R8.1
N$54
  Top 0.254: R24.2 41.48,19.9 C62.1 39.37,20.54 U$57.P$4
  Top 0.61: U$57.P$2 U$57.P$4 41.29,25.41 41.29,27.3 41.92,27.94 U$56.P$5
N$55
  Top 0.254: R27.2 59.05,19.47 R8.2 69.35,13.34 BATT2_SWITCH.P$2
N$57
  Top 0.254: LED8.A R33.1
N$62
  Top 0.254: BATT1_IC.8 15.5,44.13 15.09,43.72 11.86,43.72 11.69,43.89 11.69,45.46 11.11,46.04 R30.2 8.76,47.47 R31.2
N$64
  Top 0.254: R32.1 5.73,43.06 C70.1
N$65  (via drill 0.51)
  Top 0.254: BATT1_IC.1 14.9,48.58 13.82,49.67 C66.1 | BATT1_IC.1 15.95,49.02 C67.1 | BATT1_IC.12 17.64,41.59 v17.86,41.38 | v18.42,48.26 18.1,48.58 BATT1_IC.1
  Bottom 0.254: v17.86,41.38 17.86,41.51 19.06,42.71 19.06,46.95 19.05,46.96 19.05,47.62 v18.42,48.26
N$67
  Top 0.254: 16.29,43.4 BATT1_IC.9 15.44,43.5 15.26,43.32 11.69,43.32 9.94,45.06 | C71.1 7.5,45.06 R32.2 | 9.94,45.06 C71.1 | 9.94,45.06 C71.1
N$68
  Top 0.254: 14.92,47.94 BATT1_IC.2 BATT1_IC.3 | BATT1_IC.3 15.56,47.31 14.92,47.94 | BATT1_IC.5 16.57,46.22 17.31,46.22 17.47,46.38 17.47,46.97 17.31,47.13 16.57,47.13 BATT1_IC.3 | 14.92,47.94 13.76,49.11 12.95,49.11 12.51,49.55 C69.1 12.81,48.28 R30.1
N$69
  Top 0.254: BATT1_IC.11 16.22,42.05 15.48,42.05 15.32,41.89 15.32,41.2 C72.1
N$70
  Top 0.254: BATT1_IC.10 16.22,42.69 15.48,42.69 15.06,42.27 C73.1
N$71
  Top 0.254: BATT1_IC.13 16.57,40.78 17.31,40.78 17.47,40.62 17.47,40.03 17.36,39.92 C74.1
N$72
  Top 0.254: C75.1 15.27,39.19 BATT1_IC.14
N$75
  Top 0.254: BATT1_IC.24 21.88,46.22 22.62,46.22 23.83,47.42 C78.1
N$76
  Top 0.254: 26.73,47.06 C78.2 | BATT1_IC.23 21.88,45.58 22.62,45.58 23.43,46.39 25.44,46.39 25.6,46.56 25.6,46.65 C78.2 | C78.2 27.78,48.84 D1.C
N$79  (via drill 0.51)
  Top 0.254: BATT1_IC.21 22.5,44.13 22.59,44.22 24.06,44.22 v24.84,45.01
  Bottom 0.254: v24.84,45.01 27.6,47.76 U$37.GATE
N$80  (via drill 0.51)
  Top 0.254: BATT1_IC.25 21.88,46.85 22.62,46.85 23.17,47.39 v23.17,48.26
  Bottom 0.254: v23.17,48.26 23.62,48.6 25.93,48.6 26.41,49.19 B1-HFET.GATE
N$81
  Bottom 2.54: U$37.DRAIN 29.81,50.2 29.85,50.17 31.11,50.17
  Bottom 3.81: 31.11,50.17 31.57,50.17 L1.P$1
  pour Bottom (isolate 0.305, rank 2, no thermals): 27.31,48.26 30.48,48.26 30.48,52.07 26.04,52.07 26.04,49.53 27.31,49.53
N$82  (via drill 0.51)
  Top 0.254: BATT1_IC.20 21.88,43.67 22.62,43.67 22.76,43.81 v24.77,43.81
  Bottom 0.254: 28.57,47.62 v24.77,43.81 | 28.57,47.62 28.9,47.95 U$37.SOURCE2 U$37.SOURCE3 | U$37.SOURCE3 U$37.SOURCE1 29.04,47.62 28.57,47.62 | U$37.SOURCE3 28.57,47.81 28.57,47.62
N$83
  Top 0.254: BATT1_IC.22 23.49,44.77 24.52,45.79 25.17,45.79 25.63,45.33 25.63,44.59 27.08,43.14 C79.1 27.08,43.75 D1.A
N$84  (via drill 0.51)
  Top 0.254: BATT1_IC.4 16.22,46.85 15.44,46.85 15.3,46.99 v14.61,46.99
  Bottom 0.254: v14.61,46.99 9.53,43.18 U$40.P$1
PGND_2  (via drill 0.6)
  Top 0.254: v55.64,38.7 56.2,39.05 U$1.20
  Bottom 0.305: U$3.SOURCE3 65.27,38.84 U$3.SOURCE2
  Bottom 1.016: U$3.SOURCE2 U$3.SOURCE1 | 65.27,38.84 65.17,38.73 v55.64,38.7
THM_2  (via drill 0.18)
  Top 0.254: U$1.4 53.34,42.23 v53.34,41.91
  Bottom 0.254: v53.34,41.91 53.34,38.1 57.78,31.12 57.78,25.4 61.94,22.51 U$6.P$1
V_SHORE  (via drill 0.18, 0.6)
  Top 0.254: U$12.P$1 65.58,23.84 R20.2 65.58,23.95 v66.67,22.86 | U$10.P$1 69.92,23.69 R16.2 69.92,24.06 v71.12,22.86 | U$11.P$1 74.55,23.88 | R18.2 74.55,23.88 | 74.55,23.88 74.55,23.87 v75.56,22.86 | U$7.P$1 8.6,51.86 R10.2 | U$8.P$1 8.6,56.3 R12.2 | U$9.P$1 8.6,61.38 R14.2 | U$57.P$3 34.08,20.8 C61.1
  Top 1.016: R10.2 9.92,52.25 11.75,52.25 15.24,55.73 v15.24,57.78 | R12.2 13.75,56.3 v15.24,57.78 | v15.24,57.78 12.43,60.59 11.65,60.59 10.86,61.38 R14.2 | U$57.P$3 33.68,17.17 v33.66,17.15
  Top 1.778: R28.2 62.86,60.11 62.86,60.96 64.13,59.69 24V-TVS_OUT.P$2
  Top 3.81: SHORE_OUT.P$1 63.56,61.99 24V-TVS_OUT.P$2
  Bottom 0.254: v75.56,22.86 77.47,24.77
  Bottom 1.016: v33.66,17.15 60.78,17.15 61.47,17.84 70.54,17.84 77.47,24.77 77.47,29.21 | 77.47,29.21 77.47,33.66 | 77.47,33.66 77.47,47.62 64.48,47.62 U$5.A | v71.12,22.86 77.47,29.21 | v66.67,22.86 77.47,33.66
  Bottom 1.27: B1-ZENER.A 28.02,53.98 24.21,57.78 v15.24,57.78
  pour Bottom (isolate 0.406, no thermals): 28.57,55.25 28.57,52.7 33.02,52.7 39.37,46.36 67.31,46.36 67.31,73.03 43.18,73.03 43.18,59.06 33.66,59.06 33.66,55.25
VIN
  Top 3.81: SHORE_IN.P$1 29.15,60.44 24V-TVS_1.P$2
  Bottom 0.254: R26.1 34.97,67.31 34.77,67.11 33.1,67.11 32.9,67.31 SHORE_IN.P$1
  Bottom 6.452: SHORE_IN.P$1 29.15,60.39 U$19.TAB

### Text on the board
tPlace: Ben Hurwitz / R@M / 2017